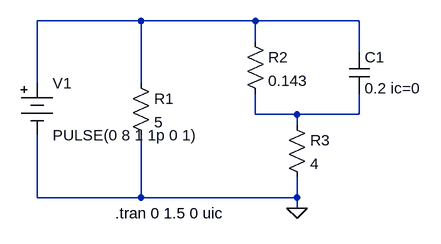
[diagram p0: schematic g4_p4.asc]
g4_p4.asc, the LTspice schematic file:
Version 4
SHEET 1 880 680
WIRE -128 16 -288 16
WIRE 48 16 -128 16
WIRE 208 16 48 16
WIRE 48 48 48 16
WIRE 208 64 208 16
WIRE -288 112 -288 16
WIRE -128 112 -128 16
WIRE 48 160 48 128
WIRE 112 160 48 160
WIRE 208 160 208 128
WIRE 208 160 112 160
WIRE 112 176 112 160
WIRE -288 288 -288 192
WIRE -128 288 -128 192
WIRE -128 288 -288 288
WIRE 112 288 112 256
WIRE 112 288 -128 288
WIRE 112 304 112 288
FLAG 112 304 0
SYMBOL cap 192 64 R0
SYMATTR InstName C1
SYMATTR Value 0.2 ic=0
SYMBOL Misc\\battery -288 96 R0
WINDOW 123 0 0 Left 0
WINDOW 39 0 0 Left 0
SYMATTR InstName V1
SYMATTR Value PULSE(0 8 1 1p 0 1)
SYMBOL res -144 96 R0
SYMATTR InstName R1
SYMATTR Value 5
SYMBOL res 32 32 R0
SYMATTR InstName R2
SYMATTR Value 0.143
SYMBOL res 96 160 R0
SYMATTR InstName R3
SYMATTR Value 4
TEXT -168 312 Left 2 !.tran 0 1.5 0 uic

The netlist it stands for:
* g4_p4.asc
C1 N001 N002 0.2 ic=0
V1 N001 0 PULSE(0 8 1 1p 0 1)
R1 N001 0 5
R2 N001 N002 0.143
R3 N002 0 4
.tran 0 1.5 0 uic
.backanno
.end